# EAGLE design akabeacon_square_da14580 (EAGLE 7.2.0)
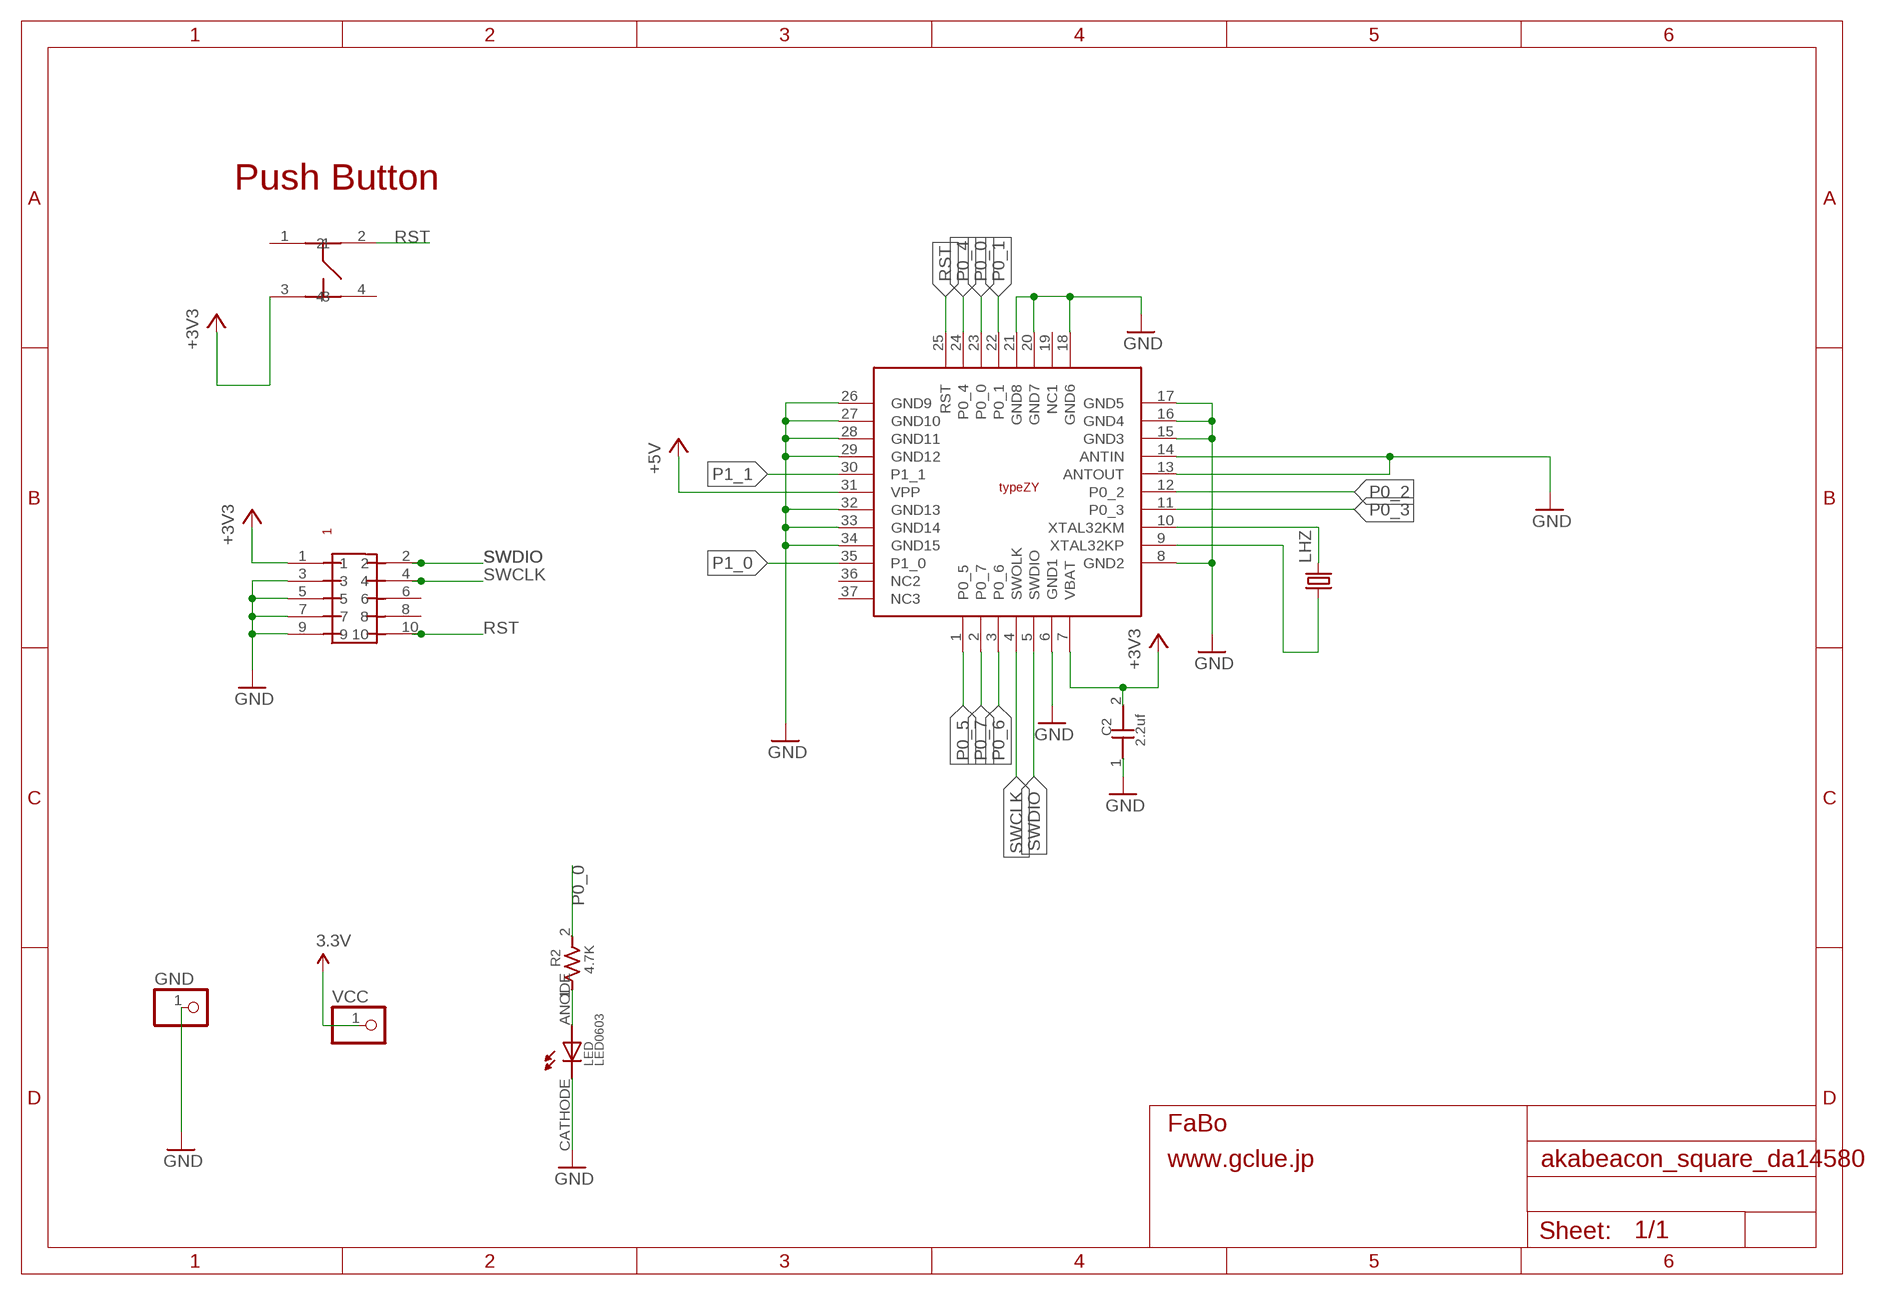
[diagram p0: schematic, sheet 1]

## Parts
C2  2.2uf  CAPACITOR0603  [0603]
GND  PINHD-1X1CB  [1X01-CLEANBIG]
LED  LED0603  [0603]
LHZ  FC-12M  [FC-12M]
R2  4.7K  RESISTOR0603  [0603]
U$6  PIN-HEADER-SMT(1.27MM)2X5  [PIN-HEADER-SMT(1.27MM)2X5]
U$7  SWICTH-4P(KMR2)  [SWITCH-4P(KMR2)]
U$9  MURATA-TYPEZY  [MURATA_TYPEZY]
VCC  PINHD-1X1CB  [1X01-CLEANBIG]

## Nets
3.3V: VCC.1
+3V3: C2.2 U$6.1 U$7.3 U$9.7(VBAT)
+5V: U$9.31(VPP)
GND: C2.1 GND.1 LED.CATHODE U$6.3 U$6.5 U$6.7 U$6.9 U$9.6(GND1) U$9.8(GND2) U$9.13(ANTOUT) U$9.14(ANTIN) U$9.15(GND3) U$9.16(GND4) U$9.17(GND5) U$9.18(GND6) U$9.20(GND7) U$9.21(GND8) U$9.26(GND9) U$9.27(GND10) U$9.28(GND11) U$9.29(GND12) U$9.32(GND13) U$9.33(GND14) U$9.34(GND15)
N$2: LED.ANODE R2.1
P0_0: R2.2 U$9.23(P0_0)
P0_1: U$9.22(P0_1)
P0_2: U$9.12(P0_2)
P0_3: U$9.11(P0_3)
P0_4: U$9.24(P0_4)
P0_5: U$9.1(P0_5)
P0_6: U$9.3(P0_6)
P0_7: U$9.2(P0_7)
P1_0: U$9.35(P1_0)
P1_1: U$9.30(P1_1)
RST: U$6.10 U$7.2 U$9.25(RST)
SWCLK: U$6.4 U$9.4(SWOLK)
SWDIO: U$6.2 U$9.5(SWDIO)
XTAL32KM: LHZ.2 U$9.10(XTAL32KM)
XTAL32KP: LHZ.1 U$9.9(XTAL32KP)
Unconnected: U$6.6 U$6.8 U$7.1 U$7.4 U$9.19(NC1) U$9.36(NC2) U$9.37(NC3)

## Notes on the sheet
- Push Button

## Library data of the parts
C2 = GClue-Capacitor:CAPACITOR
GND VCC = adafruit:PINHD-1X1: Pin header 1x1 for 0.1" spacing With round pins
LED = GClue-LED:LED
LHZ = crystal:FC-12M: kHz RANGE CRYSTAL UNIT LOW PROFILE SMD Source: Epson Toyocom FC-12M.pdf
R2 = GClue-Resistors:RESISTOR
U$6 = gclue:PIN-HEADER-SMT(1.27MM)2X5: PIN-HEADER-SMT (1.27MM) 2x5
U$7 = gclue-test:SWICTH-4P(KMR2)
U$9 = GClueBT:MURATA-TYPEZY

## Net classes
0 default: width 0.203 mm

## Board
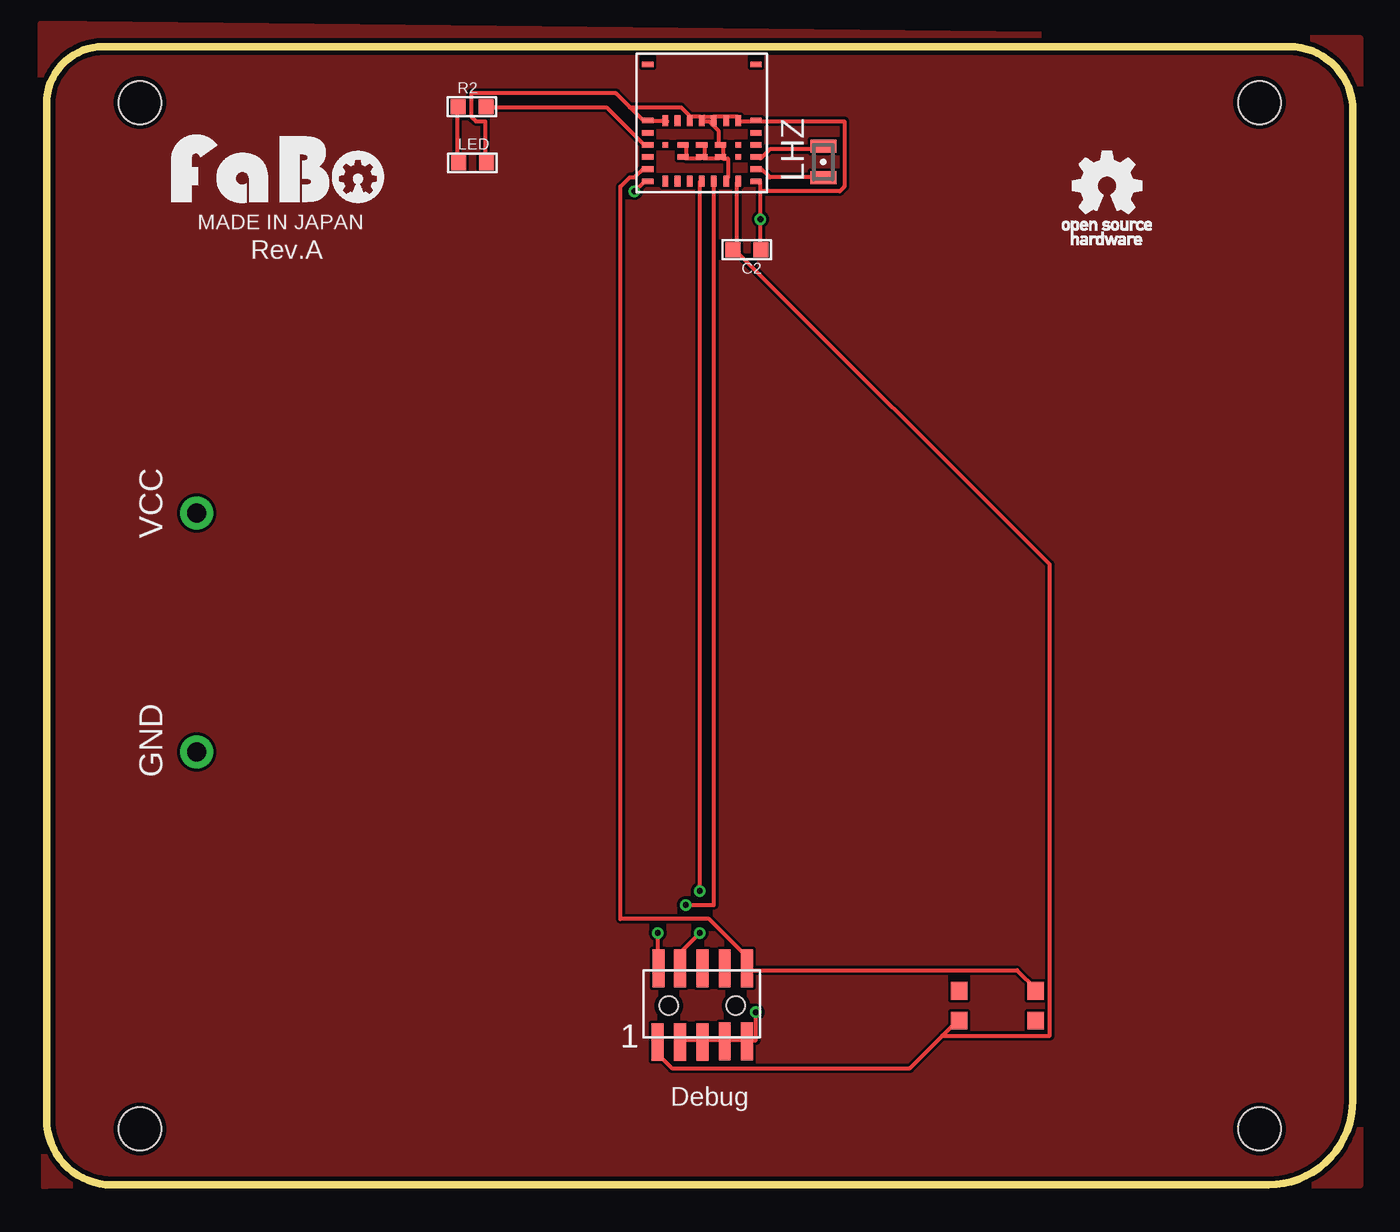
[diagram p1: board, top side]
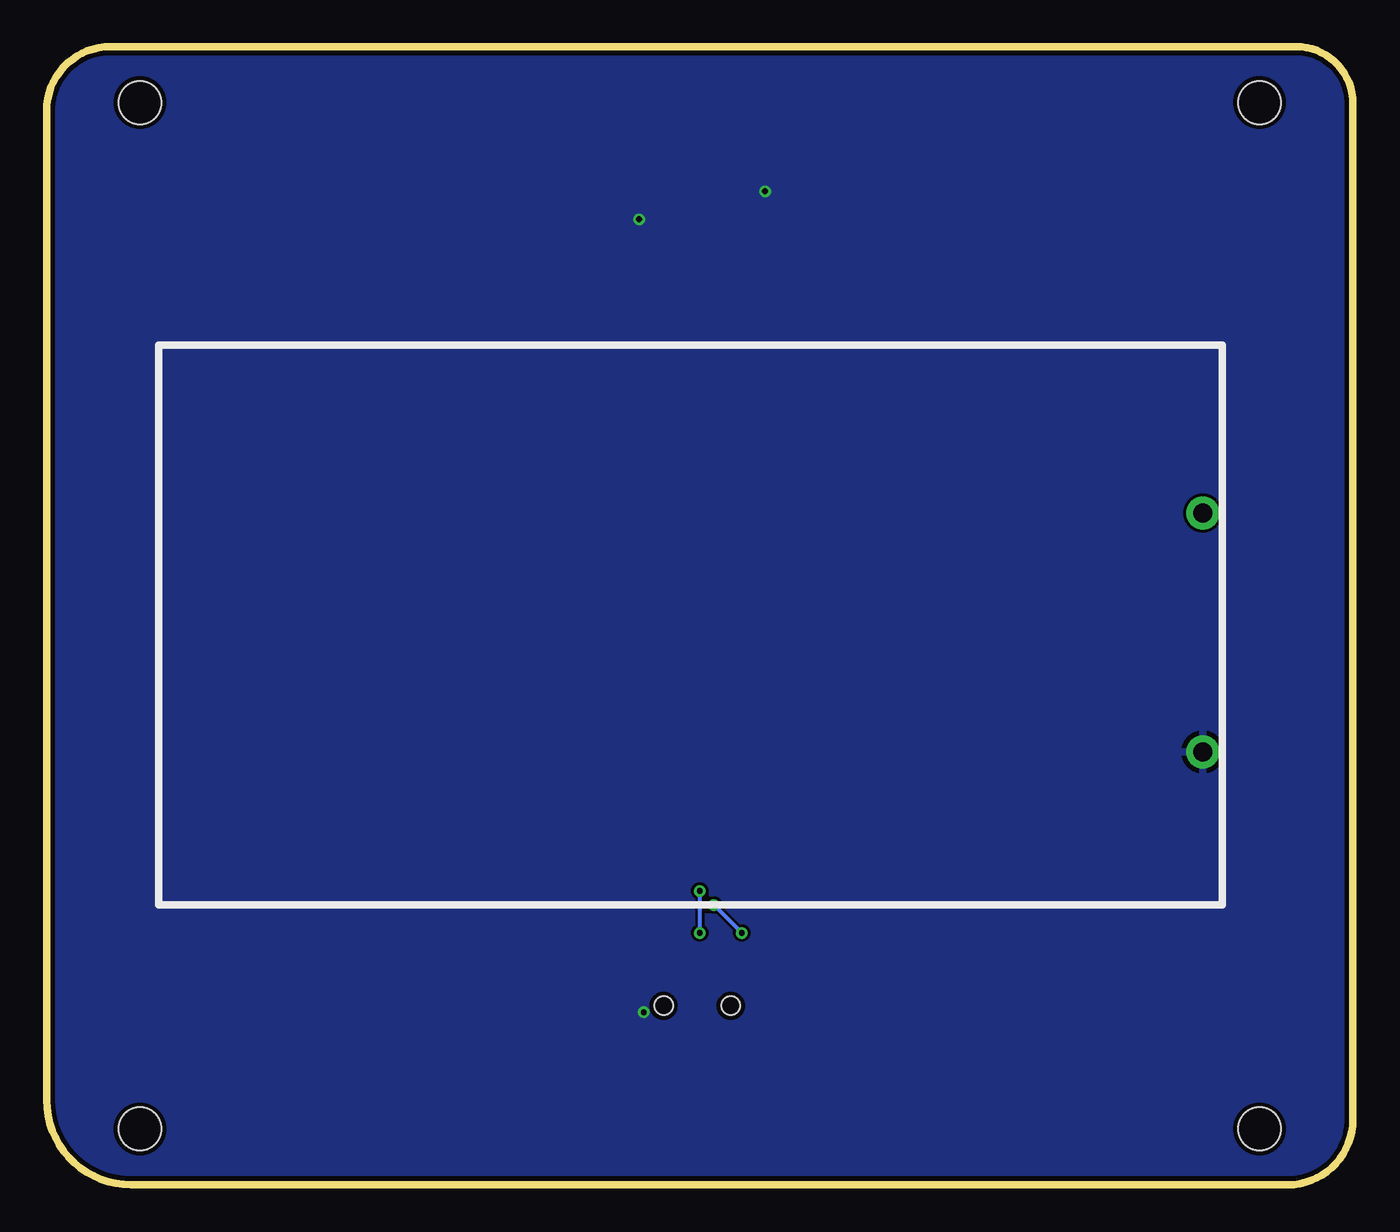
[diagram p2: board, bottom side, seen from below]

Size 70 x 61 mm. Coordinates in mm from the lower left corner, seen from the top.
Outline: 0,57.97 0,3.49 arc90 3.49,0 65.47,0 arc90 70,4.53 70,57.58 arc90 66.58,61 3.03,61 arc90 0,57.97
Copper layers (1*16): Top 0.035mm / dielectric 1.5mm / Bottom 0.035mm
Design rules "SeeedStudio_2layer_DRU_no_angle_20140221": minimum track width 6mil, minimum drill 12mil, track to track 6mil, track to pad 6mil, pad to pad 6mil, via to via 6mil, smd to smd 0mil, copper to edge 10mil, drill to drill 10mil, minimum pad ring 10mil, minimum via ring 6mil, stop-mask expansion 2mil, vias tented up to drill 100mil, thermal gap 10mil
Holes 2.3 mm at 5,3 5,58 65,58 65,3

### Footprints (pad centres in the part's own frame; a part is rotated, then mirrored left to right if it is on the bottom)
0603 = smd 0.8 x 0.8: 1 -0.75,0; 2 0.75,0
1X01-CLEANBIG = drill 1.016 pad 1.778: 1 0,0
0603' = smd 0.8 x 0.8: ANODE -0.75,0; CATHODE 0.75,0
FC-12M = smd 0.7 x 1.4: 1 -0.85,0; 2 0.85,0
PIN-HEADER-SMT(1.27MM)2X5 = smd 0.635 x 2.032: 1 -2.4,-1.95; 2 -2.35,2; 3 -1.2,-1.95; 4 -1.2,2; 5 0,-1.95; 6 0,2; 7 1.2,-1.9; 8 1.2,2; 9 2.4,-1.9; 10 2.4,2 | hole 1: 1.8,0; -1.8,0
SWITCH-4P(KMR2) = smd 0.9 x 0.95: 1 -1,0; 2 3.1,0; 3 -1,-1.6; 4 3.1,-1.6
MURATA_TYPEZY = smd 0.3 x 0.6: 1 -1.95,-1.625; 2 -1.3,-1.625; 3 -0.65,-1.625; 4 0,-1.625; 5 0.65,-1.625; 6 1.3,-1.625; 7 1.95,-1.625; 14 1.95,1.625; 15 1.3,1.625; 16 0.65,1.625; 17 0,1.625; 18 -0.65,1.625; 19 -1.3,1.625; 20 -1.95,1.625 | smd 0.6 x 0.3: 8 2.9,-1.625; 9 2.9,-0.975; 10 2.9,-0.325; 11 2.9,0.325; 12 2.9,0.975; 13 2.9,1.625; 21 -2.9,1.625; 22 -2.9,0.975; 23 -2.9,0.325; 24 -2.9,-0.325; 25 -2.9,-0.975; 26 -2.9,-1.625; 27 -1,-0.325; 28 0,-0.325; 29 1,-0.325; 32 1,0.325; 33 0,0.325; 34 -1,0.325; 36 2.9,4.625; 37 -2.9,4.625 | smd 0.3 x 0.3: 30 1.95,-0.325; 31 1.95,0.325; 35 -1.95,0.325

### Placement (x,y rotation side)
C2  37.53,50.12 180 top
GND  8.04,23.2 90 top
LED  LED0603  [0603']  22.82,54.77 0 top
LHZ  41.62,54.82 90 top
R2  22.79,57.78 0 top
U$2  [LOGO_FABO_M]  12.39,52.63 0 top
U$4  [LOGO_OSHW_T_M]  56.83,53.53 0 top
U$6  35.14,9.6 0 top
U$7  49.9,10.4 0 top
U$9  35.11,55.41 0 top
VCC  8.04,36 90 top

### Tracks (layer width: path | path; a pad name or v marks a point on that pad's centre or on a via)
+3V3
  Top 0.203: U$9.7 37,53.75 37,50.25 C2.2 37,50 53.75,33.25 53.75,8 48,8 | 48,8 46.25,6.25 33.5,6.25 32.75,7 32.75,7.5 U$6.1 | 48,8 48.75,8.75 U$7.3
AGND
  pour Top: 0,0 70.36,0 70.36,61.42 -0.3,62.2 -0.1,-0.1
GND  (via drill 0.3)
  Top 0.203: 34.25,55 34.25,55.75 U$9.34 | 35.25,55 35.25,55.75 U$9.33 | 34.25,55 35,55 U$9.28 35.25,55 | 34.25,55 U$9.27 | 36.25,55 36.25,55.75 U$9.32 36,55.75 36,56.5 35.5,57 35.25,57 U$9.17 | 36.25,55 36.5,55 36.5,54 U$9.6 | 36.25,55 U$9.29 36,55 35.25,55 | 38.25,53.25 v38.25,51.75 38.25,50.25 C2.1 | 38.25,53.25 38.25,53.75 U$9.8 | 34.5,57.25 35,57.25 U$9.17 | 35.75,57.25 35.25,57.25 U$9.17 | 36.5,57.25 37,57.25 U$9.14 37,57 38,57 U$9.13 38.25,57 42.75,57 42.75,53.5 42.5,53.25 38.25,53.25 | 36.5,57.25 35.75,57.25 | 35.75,57.25 U$9.16 | 36.5,57.25 U$9.15 | U$9.20 33.25,57 32.25,57 U$9.21 32,57 31.25,57.75 | 31.25,57.75 30.5,58.5 22.75,58.5 22.75,57.25 23,57 23.5,57 23.5,55 LED.CATHODE | 34.5,57.25 34,57.75 31.25,57.75 | 34.5,57.25 U$9.18 | U$6.3 34,7.75 35,7.75 U$6.5 35.25,7.75 36.25,7.75 U$6.7 36.5,7.75 37.5,7.75 U$6.9 37.75,7.75 38,7.75 v38,9.25 | v31.5,53.25 32,53.75 U$9.26
  pour Bottom: -0.1,-0.2 70.36,-0.2 70.36,61.52 -0.2,61.52 -0.2,-0.49
N$2
  Top 0.203: LED.ANODE 22,55 22,57.75 R2.1
P0_0
  Top 0.203: U$9.23 32,55.75 30,57.75 23.75,57.75 R2.2
RST
  Top 0.203: U$9.25 32,54.5 31.5,54 31.25,54 30.75,53.5 30.75,14.25 35.5,14.25 37.5,12.25 37.5,11.75 U$6.10 37.75,11.5 52,11.5 53,10.5 U$7.2
SWCLK  (via drill 0.3)
  Top 0.203: v35,15.75 35,53.75 U$9.4 | v35,13.5 34,12.5 34,11.75 U$6.4
  Bottom 0.203: v35,13.5 v35,15.75
SWDIO  (via drill 0.3)
  Top 0.203: v34.25,15 35.75,15 35.75,53.75 U$9.5 | v32.75,13.5 32.75,11.75 U$6.2
  Bottom 0.203: v32.75,13.5 v34.25,15
XTAL32KM
  Top 0.203: U$9.10 38.25,55 38.75,55.5 41.5,55.5 LHZ.2
XTAL32KP
  Top 0.203: U$9.9 38.25,54.5 38.75,54 41.5,54 LHZ.1

### Text on the board
tPlace: MADE IN JAPAN | Rev.A | Debug